# Altium schematic sheet TG21_mach_nut_nhan _V1_ReV.SchDoc
size A1; SheetNumber: 1; SheetTotal: 2
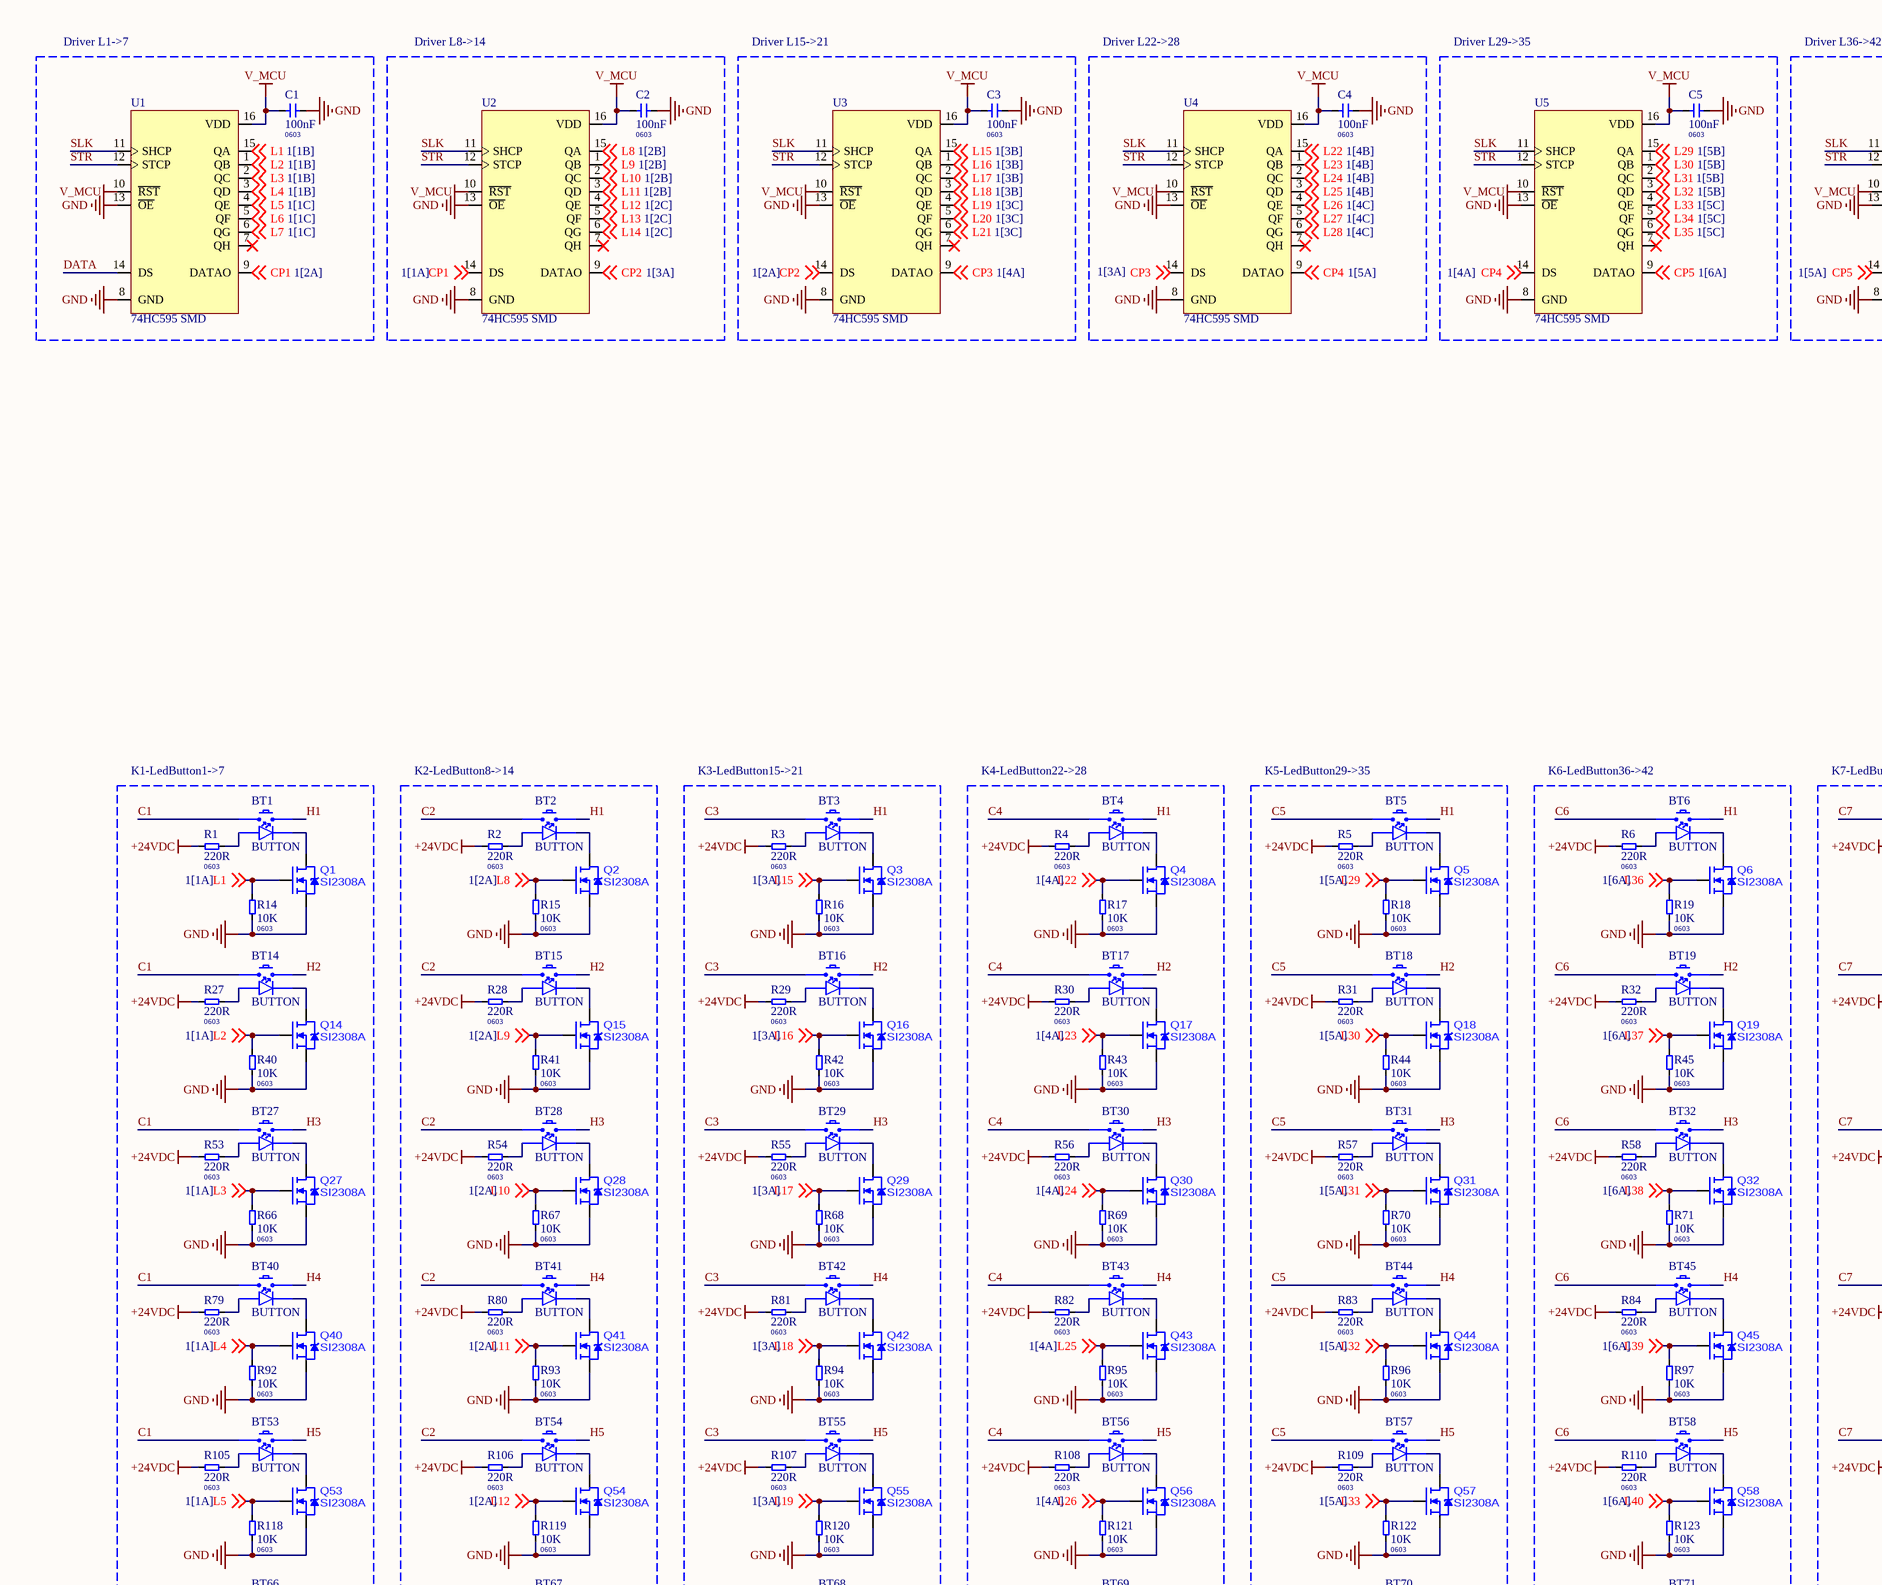
[diagram p0: TG21_mach_nut_nhan _V1_ReV.SchDoc, top left]
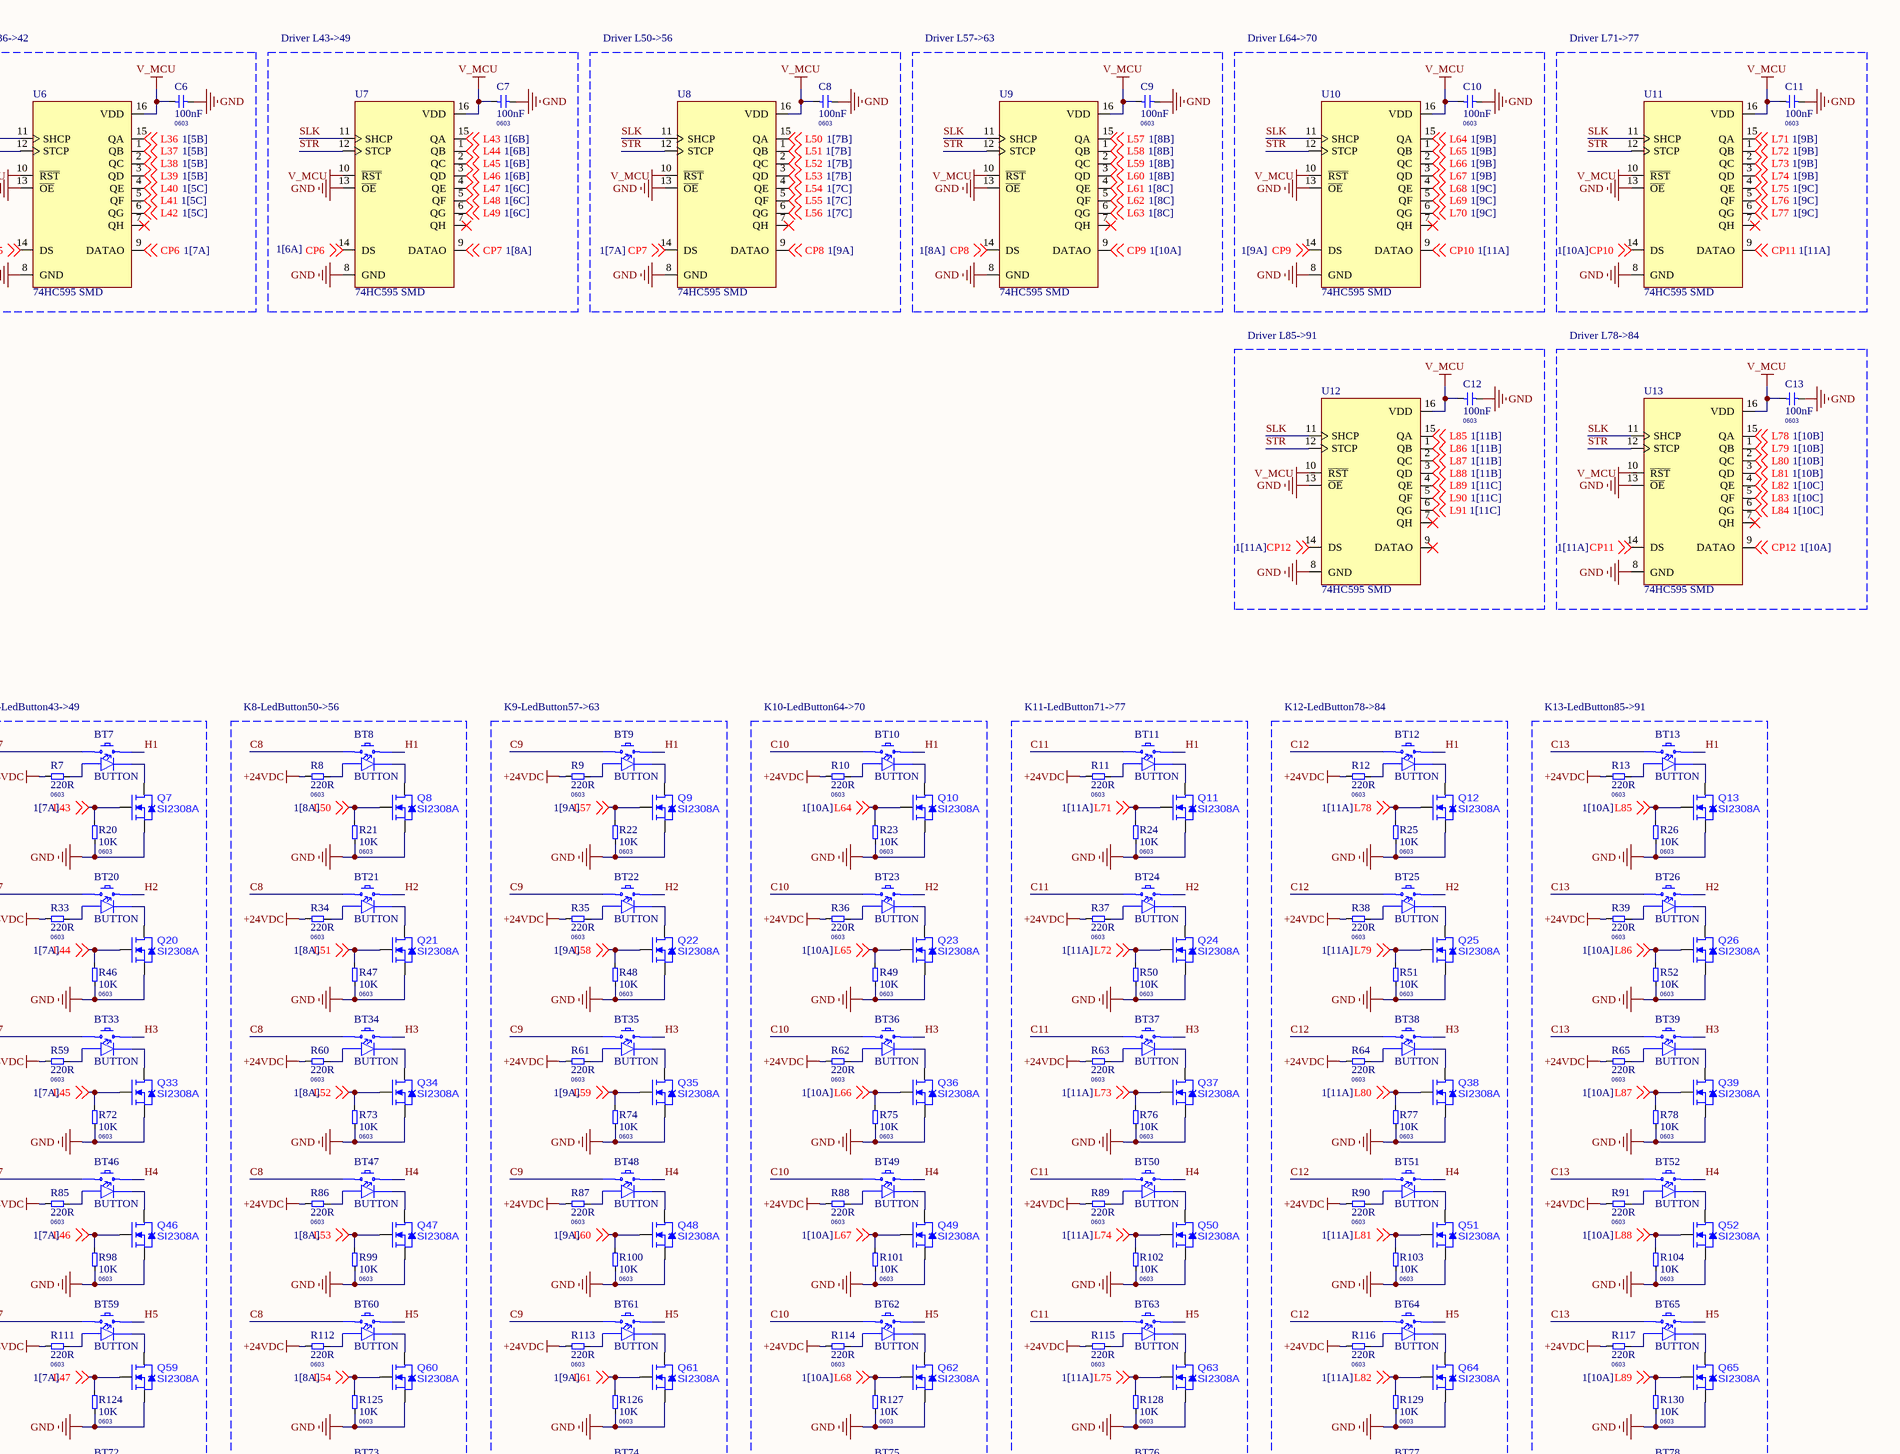
[diagram p1: TG21_mach_nut_nhan _V1_ReV.SchDoc, top right]
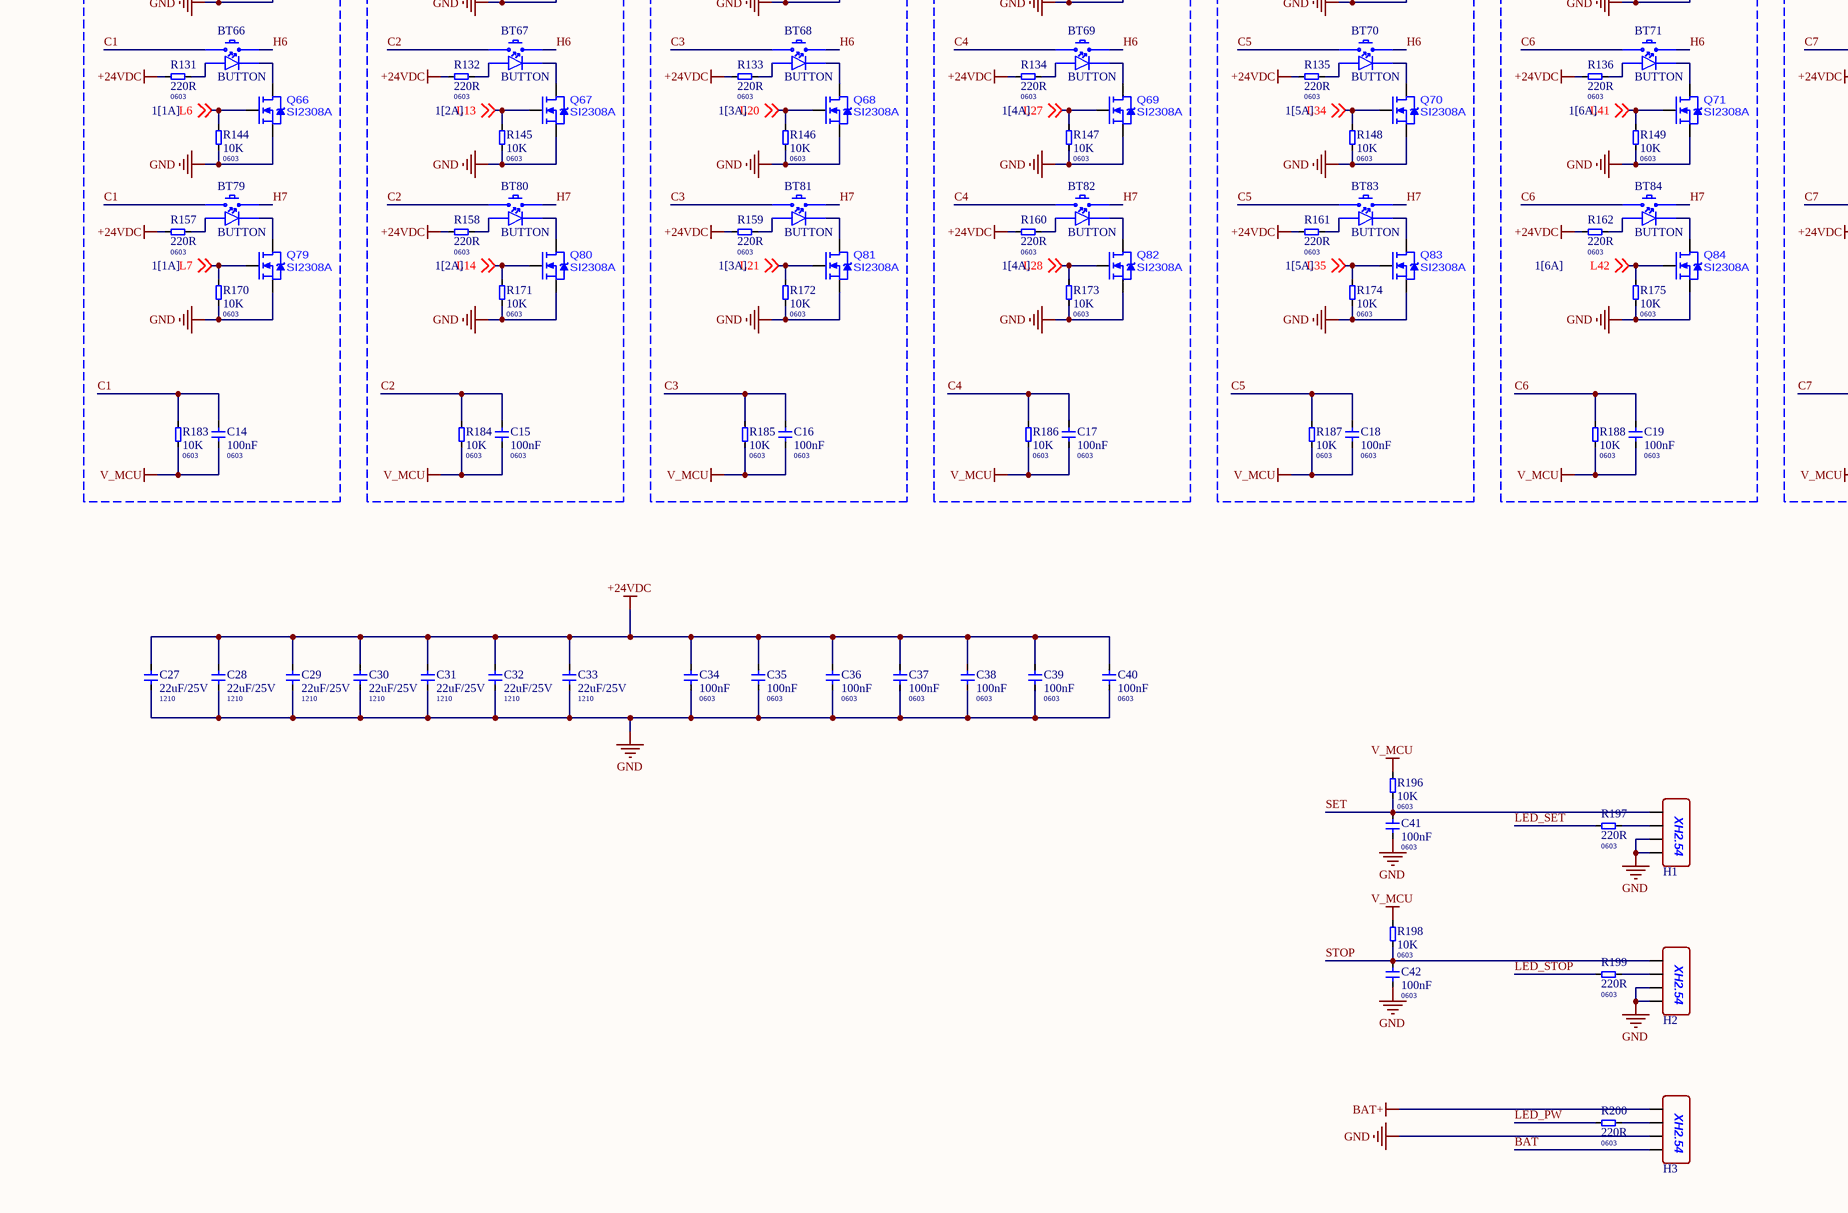
[diagram p2: TG21_mach_nut_nhan _V1_ReV.SchDoc, bottom left]
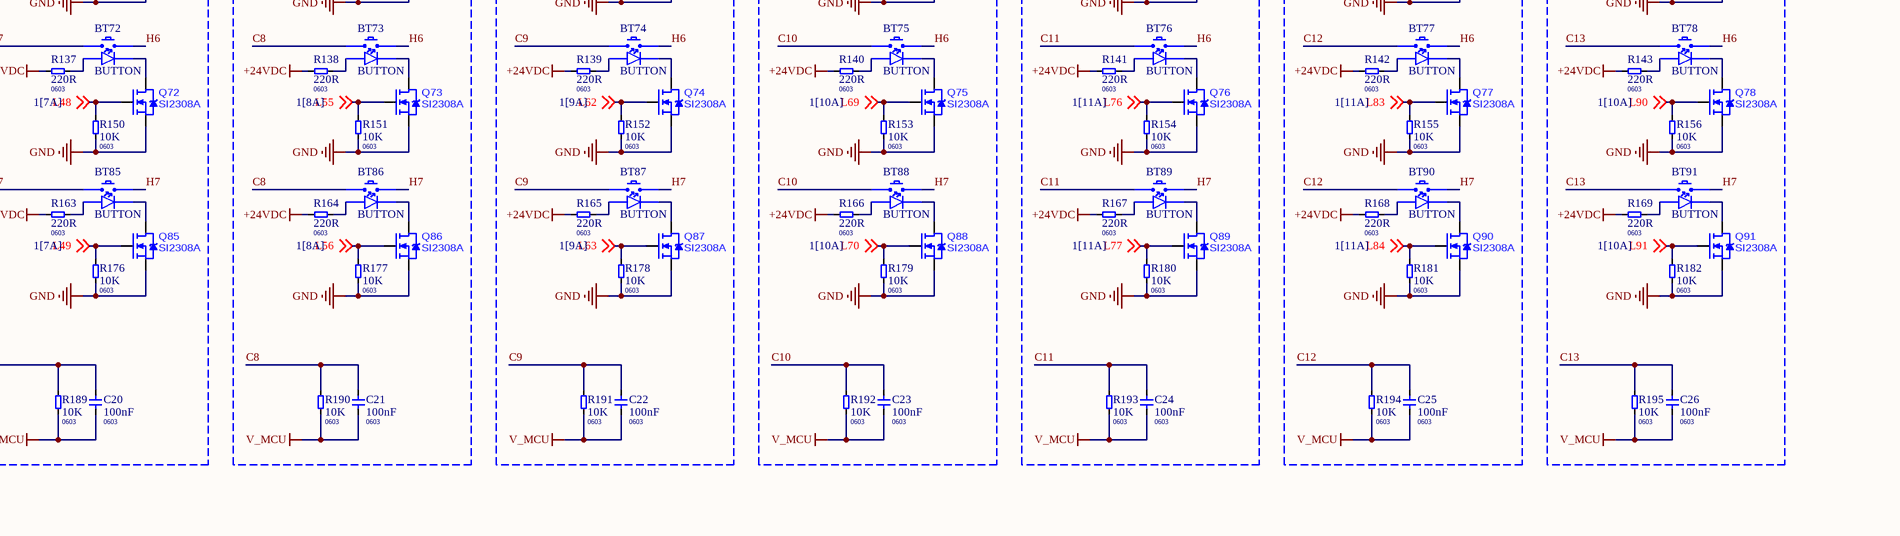
[diagram p3: TG21_mach_nut_nhan _V1_ReV.SchDoc, bottom right]

## Parts
BT1  BUTTON  [Metal Push Button Switch]
BT2  BUTTON  [Metal Push Button Switch]
BT3  BUTTON  [Metal Push Button Switch]
BT4  BUTTON  [Metal Push Button Switch]
BT5  BUTTON  [Metal Push Button Switch]
BT6  BUTTON  [Metal Push Button Switch]
BT7  BUTTON  [Metal Push Button Switch]
BT8  BUTTON  [Metal Push Button Switch]
BT9  BUTTON  [Metal Push Button Switch]
BT10  BUTTON  [Metal Push Button Switch]
BT11  BUTTON  [Metal Push Button Switch]
BT12  BUTTON  [Metal Push Button Switch]
BT13  BUTTON  [Metal Push Button Switch]
BT14  BUTTON  [Metal Push Button Switch]
BT15  BUTTON  [Metal Push Button Switch]
BT16  BUTTON  [Metal Push Button Switch]
BT17  BUTTON  [Metal Push Button Switch]
BT18  BUTTON  [Metal Push Button Switch]
BT19  BUTTON  [Metal Push Button Switch]
BT20  BUTTON  [Metal Push Button Switch]
BT21  BUTTON  [Metal Push Button Switch]
BT22  BUTTON  [Metal Push Button Switch]
BT23  BUTTON  [Metal Push Button Switch]
BT24  BUTTON  [Metal Push Button Switch]
BT25  BUTTON  [Metal Push Button Switch]
BT26  BUTTON  [Metal Push Button Switch]
BT27  BUTTON  [Metal Push Button Switch]
BT28  BUTTON  [Metal Push Button Switch]
BT29  BUTTON  [Metal Push Button Switch]
BT30  BUTTON  [Metal Push Button Switch]
BT31  BUTTON  [Metal Push Button Switch]
BT32  BUTTON  [Metal Push Button Switch]
BT33  BUTTON  [Metal Push Button Switch]
BT34  BUTTON  [Metal Push Button Switch]
BT35  BUTTON  [Metal Push Button Switch]
BT36  BUTTON  [Metal Push Button Switch]
BT37  BUTTON  [Metal Push Button Switch]
BT38  BUTTON  [Metal Push Button Switch]
BT39  BUTTON  [Metal Push Button Switch]
BT40  BUTTON  [Metal Push Button Switch]
BT41  BUTTON  [Metal Push Button Switch]
BT42  BUTTON  [Metal Push Button Switch]
BT43  BUTTON  [Metal Push Button Switch]
BT44  BUTTON  [Metal Push Button Switch]
BT45  BUTTON  [Metal Push Button Switch]
BT46  BUTTON  [Metal Push Button Switch]
BT47  BUTTON  [Metal Push Button Switch]
BT48  BUTTON  [Metal Push Button Switch]
BT49  BUTTON  [Metal Push Button Switch]
BT50  BUTTON  [Metal Push Button Switch]
BT51  BUTTON  [Metal Push Button Switch]
BT52  BUTTON  [Metal Push Button Switch]
BT53  BUTTON  [Metal Push Button Switch]
BT54  BUTTON  [Metal Push Button Switch]
BT55  BUTTON  [Metal Push Button Switch]
BT56  BUTTON  [Metal Push Button Switch]
BT57  BUTTON  [Metal Push Button Switch]
BT58  BUTTON  [Metal Push Button Switch]
BT59  BUTTON  [Metal Push Button Switch]
BT60  BUTTON  [Metal Push Button Switch]
BT61  BUTTON  [Metal Push Button Switch]
BT62  BUTTON  [Metal Push Button Switch]
BT63  BUTTON  [Metal Push Button Switch]
BT64  BUTTON  [Metal Push Button Switch]
BT65  BUTTON  [Metal Push Button Switch]
BT66  BUTTON  [Metal Push Button Switch]
BT67  BUTTON  [Metal Push Button Switch]
BT68  BUTTON  [Metal Push Button Switch]
BT69  BUTTON  [Metal Push Button Switch]
BT70  BUTTON  [Metal Push Button Switch]
BT71  BUTTON  [Metal Push Button Switch]
BT72  BUTTON  [Metal Push Button Switch]
BT73  BUTTON  [Metal Push Button Switch]
BT74  BUTTON  [Metal Push Button Switch]
BT75  BUTTON  [Metal Push Button Switch]
BT76  BUTTON  [Metal Push Button Switch]
BT77  BUTTON  [Metal Push Button Switch]
BT78  BUTTON  [Metal Push Button Switch]
BT79  BUTTON  [Metal Push Button Switch]
BT80  BUTTON  [Metal Push Button Switch]
BT81  BUTTON  [Metal Push Button Switch]
BT82  BUTTON  [Metal Push Button Switch]
BT83  BUTTON  [Metal Push Button Switch]
BT84  BUTTON  [Metal Push Button Switch]
BT85  BUTTON  [Metal Push Button Switch]
BT86  BUTTON  [Metal Push Button Switch]
BT87  BUTTON  [Metal Push Button Switch]
BT88  BUTTON  [Metal Push Button Switch]
BT89  BUTTON  [Metal Push Button Switch]
BT90  BUTTON  [Metal Push Button Switch]
BT91  BUTTON  [Metal Push Button Switch]
C1  100nF  Package: 0603  [0603 MLCC]
C2  100nF  Package: 0603  [0603 MLCC]
C3  100nF  Package: 0603  [0603 MLCC]
C4  100nF  Package: 0603  [0603 MLCC]
C5  100nF  Package: 0603  [0603 MLCC]
C6  100nF  Package: 0603  [0603 MLCC]
C7  100nF  Package: 0603  [0603 MLCC]
C8  100nF  Package: 0603  [0603 MLCC]
C9  100nF  Package: 0603  [0603 MLCC]
C10  100nF  Package: 0603  [0603 MLCC]
C11  100nF  Package: 0603  [0603 MLCC]
C12  100nF  Package: 0603  [0603 MLCC]
C13  100nF  Package: 0603  [0603 MLCC]
C14  100nF  Package: 0603  [0603 MLCC]
C15  100nF  Package: 0603  [0603 MLCC]
C16  100nF  Package: 0603  [0603 MLCC]
C17  100nF  Package: 0603  [0603 MLCC]
C18  100nF  Package: 0603  [0603 MLCC]
C19  100nF  Package: 0603  [0603 MLCC]
C20  100nF  Package: 0603  [0603 MLCC]
C21  100nF  Package: 0603  [0603 MLCC]
C22  100nF  Package: 0603  [0603 MLCC]
C23  100nF  Package: 0603  [0603 MLCC]
C24  100nF  Package: 0603  [0603 MLCC]
C25  100nF  Package: 0603  [0603 MLCC]
C26  100nF  Package: 0603  [0603 MLCC]
C27  22uF/25V  Package: 1210  [1210 CAPACITOR]
C28  22uF/25V  Package: 1210  [1210 CAPACITOR]
C29  22uF/25V  Package: 1210  [1210 CAPACITOR]
C30  22uF/25V  Package: 1210  [1210 CAPACITOR]
C31  22uF/25V  Package: 1210  [1210 CAPACITOR]
C32  22uF/25V  Package: 1210  [1210 CAPACITOR]
C33  22uF/25V  Package: 1210  [1210 CAPACITOR]
C34  100nF  Package: 0603  [0603 MLCC]
C35  100nF  Package: 0603  [0603 MLCC]
C36  100nF  Package: 0603  [0603 MLCC]
C37  100nF  Package: 0603  [0603 MLCC]
C38  100nF  Package: 0603  [0603 MLCC]
C39  100nF  Package: 0603  [0603 MLCC]
C40  100nF  Package: 0603  [0603 MLCC]
C41  100nF  Package: 0603  [0603 MLCC]
C42  100nF  Package: 0603  [0603 MLCC]
H1  XY-XH2.54-4PZZ  [XH2.54 - 4PZZ]  (value not drawn)
H2  XY-XH2.54-4PZZ  [XH2.54 - 4PZZ]  (value not drawn)
H3  XY-XH2.54-4PZZ  [XH2.54 - 4PZZ]  (value not drawn)
Q1  SI2308A  [SOT23_HVT]
Q2  SI2308A  [SOT23_HVT]
Q3  SI2308A  [SOT23_HVT]
Q4  SI2308A  [SOT23_HVT]
Q5  SI2308A  [SOT23_HVT]
Q6  SI2308A  [SOT23_HVT]
Q7  SI2308A  [SOT23_HVT]
Q8  SI2308A  [SOT23_HVT]
Q9  SI2308A  [SOT23_HVT]
Q10  SI2308A  [SOT23_HVT]
Q11  SI2308A  [SOT23_HVT]
Q12  SI2308A  [SOT23_HVT]
Q13  SI2308A  [SOT23_HVT]
Q14  SI2308A  [SOT23_HVT]
Q15  SI2308A  [SOT23_HVT]
Q16  SI2308A  [SOT23_HVT]
Q17  SI2308A  [SOT23_HVT]
Q18  SI2308A  [SOT23_HVT]
Q19  SI2308A  [SOT23_HVT]
Q20  SI2308A  [SOT23_HVT]
Q21  SI2308A  [SOT23_HVT]
Q22  SI2308A  [SOT23_HVT]
Q23  SI2308A  [SOT23_HVT]
Q24  SI2308A  [SOT23_HVT]
Q25  SI2308A  [SOT23_HVT]
Q26  SI2308A  [SOT23_HVT]
Q27  SI2308A  [SOT23_HVT]
Q28  SI2308A  [SOT23_HVT]
Q29  SI2308A  [SOT23_HVT]
Q30  SI2308A  [SOT23_HVT]
Q31  SI2308A  [SOT23_HVT]
Q32  SI2308A  [SOT23_HVT]
Q33  SI2308A  [SOT23_HVT]
Q34  SI2308A  [SOT23_HVT]
Q35  SI2308A  [SOT23_HVT]
Q36  SI2308A  [SOT23_HVT]
Q37  SI2308A  [SOT23_HVT]
Q38  SI2308A  [SOT23_HVT]
Q39  SI2308A  [SOT23_HVT]
Q40  SI2308A  [SOT23_HVT]
Q41  SI2308A  [SOT23_HVT]
Q42  SI2308A  [SOT23_HVT]
Q43  SI2308A  [SOT23_HVT]
Q44  SI2308A  [SOT23_HVT]
Q45  SI2308A  [SOT23_HVT]
Q46  SI2308A  [SOT23_HVT]
Q47  SI2308A  [SOT23_HVT]
Q48  SI2308A  [SOT23_HVT]
Q49  SI2308A  [SOT23_HVT]
Q50  SI2308A  [SOT23_HVT]
Q51  SI2308A  [SOT23_HVT]
Q52  SI2308A  [SOT23_HVT]
Q53  SI2308A  [SOT23_HVT]
Q54  SI2308A  [SOT23_HVT]
Q55  SI2308A  [SOT23_HVT]
Q56  SI2308A  [SOT23_HVT]
Q57  SI2308A  [SOT23_HVT]
Q58  SI2308A  [SOT23_HVT]
Q59  SI2308A  [SOT23_HVT]
Q60  SI2308A  [SOT23_HVT]
Q61  SI2308A  [SOT23_HVT]
Q62  SI2308A  [SOT23_HVT]
Q63  SI2308A  [SOT23_HVT]
Q64  SI2308A  [SOT23_HVT]
Q65  SI2308A  [SOT23_HVT]
Q66  SI2308A  [SOT23_HVT]
Q67  SI2308A  [SOT23_HVT]
Q68  SI2308A  [SOT23_HVT]
Q69  SI2308A  [SOT23_HVT]
Q70  SI2308A  [SOT23_HVT]
Q71  SI2308A  [SOT23_HVT]
Q72  SI2308A  [SOT23_HVT]
Q73  SI2308A  [SOT23_HVT]
Q74  SI2308A  [SOT23_HVT]
Q75  SI2308A  [SOT23_HVT]
Q76  SI2308A  [SOT23_HVT]
Q77  SI2308A  [SOT23_HVT]
Q78  SI2308A  [SOT23_HVT]
Q79  SI2308A  [SOT23_HVT]
Q80  SI2308A  [SOT23_HVT]
Q81  SI2308A  [SOT23_HVT]
Q82  SI2308A  [SOT23_HVT]
Q83  SI2308A  [SOT23_HVT]
Q84  SI2308A  [SOT23_HVT]
Q85  SI2308A  [SOT23_HVT]
Q86  SI2308A  [SOT23_HVT]
Q87  SI2308A  [SOT23_HVT]
Q88  SI2308A  [SOT23_HVT]
Q89  SI2308A  [SOT23_HVT]
Q90  SI2308A  [SOT23_HVT]
Q91  SI2308A  [SOT23_HVT]
R1  220R  Package: 0603  [0603 MLCC]
R2  220R  Package: 0603  [0603 MLCC]
R3  220R  Package: 0603  [0603 MLCC]
R4  220R  Package: 0603  [0603 MLCC]
R5  220R  Package: 0603  [0603 MLCC]
R6  220R  Package: 0603  [0603 MLCC]
R7  220R  Package: 0603  [0603 MLCC]
R8  220R  Package: 0603  [0603 MLCC]
R9  220R  Package: 0603  [0603 MLCC]
R10  220R  Package: 0603  [0603 MLCC]
R11  220R  Package: 0603  [0603 MLCC]
R12  220R  Package: 0603  [0603 MLCC]
R13  220R  Package: 0603  [0603 MLCC]
R14  10K  Package: 0603  [0603 Resistors]
R15  10K  Package: 0603  [0603 Resistors]
R16  10K  Package: 0603  [0603 Resistors]
R17  10K  Package: 0603  [0603 Resistors]
R18  10K  Package: 0603  [0603 Resistors]
R19  10K  Package: 0603  [0603 Resistors]
R20  10K  Package: 0603  [0603 Resistors]
R21  10K  Package: 0603  [0603 Resistors]
R22  10K  Package: 0603  [0603 Resistors]
R23  10K  Package: 0603  [0603 Resistors]
R24  10K  Package: 0603  [0603 Resistors]
R25  10K  Package: 0603  [0603 Resistors]
R26  10K  Package: 0603  [0603 Resistors]
R27  220R  Package: 0603  [0603 MLCC]
R28  220R  Package: 0603  [0603 MLCC]
R29  220R  Package: 0603  [0603 MLCC]
R30  220R  Package: 0603  [0603 MLCC]
R31  220R  Package: 0603  [0603 MLCC]
R32  220R  Package: 0603  [0603 MLCC]
R33  220R  Package: 0603  [0603 MLCC]
R34  220R  Package: 0603  [0603 MLCC]
R35  220R  Package: 0603  [0603 MLCC]
R36  220R  Package: 0603  [0603 MLCC]
R37  220R  Package: 0603  [0603 MLCC]
R38  220R  Package: 0603  [0603 MLCC]
R39  220R  Package: 0603  [0603 MLCC]
R40  10K  Package: 0603  [0603 Resistors]
R41  10K  Package: 0603  [0603 Resistors]
R42  10K  Package: 0603  [0603 Resistors]
R43  10K  Package: 0603  [0603 Resistors]
R44  10K  Package: 0603  [0603 Resistors]
R45  10K  Package: 0603  [0603 Resistors]
R46  10K  Package: 0603  [0603 Resistors]
R47  10K  Package: 0603  [0603 Resistors]
R48  10K  Package: 0603  [0603 Resistors]
R49  10K  Package: 0603  [0603 Resistors]
R50  10K  Package: 0603  [0603 Resistors]
R51  10K  Package: 0603  [0603 Resistors]
R52  10K  Package: 0603  [0603 Resistors]
R53  220R  Package: 0603  [0603 MLCC]
R54  220R  Package: 0603  [0603 MLCC]
R55  220R  Package: 0603  [0603 MLCC]
R56  220R  Package: 0603  [0603 MLCC]
R57  220R  Package: 0603  [0603 MLCC]
R58  220R  Package: 0603  [0603 MLCC]
R59  220R  Package: 0603  [0603 MLCC]
R60  220R  Package: 0603  [0603 MLCC]
R61  220R  Package: 0603  [0603 MLCC]
R62  220R  Package: 0603  [0603 MLCC]
R63  220R  Package: 0603  [0603 MLCC]
R64  220R  Package: 0603  [0603 MLCC]
R65  220R  Package: 0603  [0603 MLCC]
R66  10K  Package: 0603  [0603 Resistors]
R67  10K  Package: 0603  [0603 Resistors]
R68  10K  Package: 0603  [0603 Resistors]
R69  10K  Package: 0603  [0603 Resistors]
R70  10K  Package: 0603  [0603 Resistors]
R71  10K  Package: 0603  [0603 Resistors]
R72  10K  Package: 0603  [0603 Resistors]
R73  10K  Package: 0603  [0603 Resistors]
R74  10K  Package: 0603  [0603 Resistors]
R75  10K  Package: 0603  [0603 Resistors]
R76  10K  Package: 0603  [0603 Resistors]
R77  10K  Package: 0603  [0603 Resistors]
R78  10K  Package: 0603  [0603 Resistors]
R79  220R  Package: 0603  [0603 MLCC]
R80  220R  Package: 0603  [0603 MLCC]
R81  220R  Package: 0603  [0603 MLCC]
R82  220R  Package: 0603  [0603 MLCC]
R83  220R  Package: 0603  [0603 MLCC]
R84  220R  Package: 0603  [0603 MLCC]
R85  220R  Package: 0603  [0603 MLCC]
R86  220R  Package: 0603  [0603 MLCC]
R87  220R  Package: 0603  [0603 MLCC]
R88  220R  Package: 0603  [0603 MLCC]
R89  220R  Package: 0603  [0603 MLCC]
R90  220R  Package: 0603  [0603 MLCC]
R91  220R  Package: 0603  [0603 MLCC]
R92  10K  Package: 0603  [0603 Resistors]
R93  10K  Package: 0603  [0603 Resistors]
R94  10K  Package: 0603  [0603 Resistors]
R95  10K  Package: 0603  [0603 Resistors]
R96  10K  Package: 0603  [0603 Resistors]
R97  10K  Package: 0603  [0603 Resistors]
R98  10K  Package: 0603  [0603 Resistors]
R99  10K  Package: 0603  [0603 Resistors]
R100  10K  Package: 0603  [0603 Resistors]
R101  10K  Package: 0603  [0603 Resistors]
R102  10K  Package: 0603  [0603 Resistors]
R103  10K  Package: 0603  [0603 Resistors]
R104  10K  Package: 0603  [0603 Resistors]
R105  220R  Package: 0603  [0603 MLCC]
R106  220R  Package: 0603  [0603 MLCC]
R107  220R  Package: 0603  [0603 MLCC]
R108  220R  Package: 0603  [0603 MLCC]
R109  220R  Package: 0603  [0603 MLCC]
R110  220R  Package: 0603  [0603 MLCC]
R111  220R  Package: 0603  [0603 MLCC]
R112  220R  Package: 0603  [0603 MLCC]
R113  220R  Package: 0603  [0603 MLCC]
R114  220R  Package: 0603  [0603 MLCC]
R115  220R  Package: 0603  [0603 MLCC]
R116  220R  Package: 0603  [0603 MLCC]
R117  220R  Package: 0603  [0603 MLCC]
R118  10K  Package: 0603  [0603 Resistors]
R119  10K  Package: 0603  [0603 Resistors]
R120  10K  Package: 0603  [0603 Resistors]
R121  10K  Package: 0603  [0603 Resistors]
R122  10K  Package: 0603  [0603 Resistors]
R123  10K  Package: 0603  [0603 Resistors]
R124  10K  Package: 0603  [0603 Resistors]
R125  10K  Package: 0603  [0603 Resistors]
R126  10K  Package: 0603  [0603 Resistors]
R127  10K  Package: 0603  [0603 Resistors]
R128  10K  Package: 0603  [0603 Resistors]
R129  10K  Package: 0603  [0603 Resistors]
R130  10K  Package: 0603  [0603 Resistors]
R131  220R  Package: 0603  [0603 MLCC]
R132  220R  Package: 0603  [0603 MLCC]
R133  220R  Package: 0603  [0603 MLCC]
R134  220R  Package: 0603  [0603 MLCC]
R135  220R  Package: 0603  [0603 MLCC]
R136  220R  Package: 0603  [0603 MLCC]
R137  220R  Package: 0603  [0603 MLCC]
R138  220R  Package: 0603  [0603 MLCC]
R139  220R  Package: 0603  [0603 MLCC]
R140  220R  Package: 0603  [0603 MLCC]
R141  220R  Package: 0603  [0603 MLCC]
R142  220R  Package: 0603  [0603 MLCC]
R143  220R  Package: 0603  [0603 MLCC]
R144  10K  Package: 0603  [0603 Resistors]
R145  10K  Package: 0603  [0603 Resistors]
R146  10K  Package: 0603  [0603 Resistors]
R147  10K  Package: 0603  [0603 Resistors]
R148  10K  Package: 0603  [0603 Resistors]
R149  10K  Package: 0603  [0603 Resistors]
R150  10K  Package: 0603  [0603 Resistors]
R151  10K  Package: 0603  [0603 Resistors]
R152  10K  Package: 0603  [0603 Resistors]
R153  10K  Package: 0603  [0603 Resistors]
R154  10K  Package: 0603  [0603 Resistors]
R155  10K  Package: 0603  [0603 Resistors]
R156  10K  Package: 0603  [0603 Resistors]
R157  220R  Package: 0603  [0603 MLCC]
R158  220R  Package: 0603  [0603 MLCC]
R159  220R  Package: 0603  [0603 MLCC]
R160  220R  Package: 0603  [0603 MLCC]
R161  220R  Package: 0603  [0603 MLCC]
R162  220R  Package: 0603  [0603 MLCC]
R163  220R  Package: 0603  [0603 MLCC]
R164  220R  Package: 0603  [0603 MLCC]
R165  220R  Package: 0603  [0603 MLCC]
R166  220R  Package: 0603  [0603 MLCC]
R167  220R  Package: 0603  [0603 MLCC]
R168  220R  Package: 0603  [0603 MLCC]
R169  220R  Package: 0603  [0603 MLCC]
R170  10K  Package: 0603  [0603 Resistors]
R171  10K  Package: 0603  [0603 Resistors]
R172  10K  Package: 0603  [0603 Resistors]
R173  10K  Package: 0603  [0603 Resistors]
R174  10K  Package: 0603  [0603 Resistors]
R175  10K  Package: 0603  [0603 Resistors]
R176  10K  Package: 0603  [0603 Resistors]
R177  10K  Package: 0603  [0603 Resistors]
R178  10K  Package: 0603  [0603 Resistors]
R179  10K  Package: 0603  [0603 Resistors]
R180  10K  Package: 0603  [0603 Resistors]
R181  10K  Package: 0603  [0603 Resistors]
R182  10K  Package: 0603  [0603 Resistors]
R183  10K  Package: 0603  [0603 Resistors]
R184  10K  Package: 0603  [0603 Resistors]
R185  10K  Package: 0603  [0603 Resistors]
R186  10K  Package: 0603  [0603 Resistors]
R187  10K  Package: 0603  [0603 Resistors]
R188  10K  Package: 0603  [0603 Resistors]
R189  10K  Package: 0603  [0603 Resistors]
R190  10K  Package: 0603  [0603 Resistors]
R191  10K  Package: 0603  [0603 Resistors]
R192  10K  Package: 0603  [0603 Resistors]
R193  10K  Package: 0603  [0603 Resistors]
R194  10K  Package: 0603  [0603 Resistors]
R195  10K  Package: 0603  [0603 Resistors]
R196  10K  Package: 0603  [0603 Resistors]
R197  220R  Package: 0603  [0603 Resistors]
R198  10K  Package: 0603  [0603 Resistors]
R199  220R  Package: 0603  [0603 Resistors]
R200  220R  Package: 0603  [0603 Resistors]
U1  74HC595 SMD  [SOP 16]
U2  74HC595 SMD  [SOP 16]
U3  74HC595 SMD  [SOP 16]
U4  74HC595 SMD  [SOP 16]
U5  74HC595 SMD  [SOP 16]
U6  74HC595 SMD  [SOP 16]
U7  74HC595 SMD  [SOP 16]
U8  74HC595 SMD  [SOP 16]
U9  74HC595 SMD  [SOP 16]
U10  74HC595 SMD  [SOP 16]
U11  74HC595 SMD  [SOP 16]
U12  74HC595 SMD  [SOP 16]
U13  74HC595 SMD  [SOP 16]

## Blocks framed on the sheet
Driver L1->7: C1 U1
Driver L8->14: C2 U2
Driver L15->21: C3 U3
Driver L22->28: C4 U4
Driver L29->35: C5 U5
Driver L36->42: C6 U6
Driver L43->49: C7 U7
Driver L50->56: C8 U8
Driver L57->63: C9 U9
Driver L64->70: C10 U10
Driver L71->77: C11 U11
Driver L85->91: C12 U12
Driver L78->84: C13 U13
K1-LedButton1->7: BT1 BT14 BT27 BT40 BT53 BT66 BT79 C14 Q1 Q14 Q27 Q40 Q53 Q66 Q79 R1 R14 R27 R40 R53 R66 R79 R92 R105 R118 R131 R144 R157 R170 R183
K2-LedButton8->14: BT2 BT15 BT28 BT41 BT54 BT67 BT80 C15 Q2 Q15 Q28 Q41 Q54 Q67 Q80 R2 R15 R28 R41 R54 R67 R80 R93 R106 R119 R132 R145 R158 R171 R184
K3-LedButton15->21: BT3 BT16 BT29 BT42 BT55 BT68 BT81 C16 Q3 Q16 Q29 Q42 Q55 Q68 Q81 R3 R16 R29 R42 R55 R68 R81 R94 R107 R120 R133 R146 R159 R172 R185
K4-LedButton22->28: BT4 BT17 BT30 BT43 BT56 BT69 BT82 C17 Q4 Q17 Q30 Q43 Q56 Q69 Q82 R4 R17 R30 R43 R56 R69 R82 R95 R108 R121 R134 R147 R160 R173 R186
K5-LedButton29->35: BT5 BT18 BT31 BT44 BT57 BT70 BT83 C18 Q5 Q18 Q31 Q44 Q57 Q70 Q83 R5 R18 R31 R44 R57 R70 R83 R96 R109 R122 R135 R148 R161 R174 R187
K6-LedButton36->42: BT6 BT19 BT32 BT45 BT58 BT71 BT84 C19 Q6 Q19 Q32 Q45 Q58 Q71 Q84 R6 R19 R32 R45 R58 R71 R84 R97 R110 R123 R136 R149 R162 R175 R188
K7-LedButton43->49: BT7 BT20 BT33 BT46 BT59 BT72 BT85 C20 Q7 Q20 Q33 Q46 Q59 Q72 Q85 R7 R20 R33 R46 R59 R72 R85 R98 R111 R124 R137 R150 R163 R176 R189
K8-LedButton50->56: BT8 BT21 BT34 BT47 BT60 BT73 BT86 C21 Q8 Q21 Q34 Q47 Q60 Q73 Q86 R8 R21 R34 R47 R60 R73 R86 R99 R112 R125 R138 R151 R164 R177 R190
K9-LedButton57->63: BT9 BT22 BT35 BT48 BT61 BT74 BT87 C22 Q9 Q22 Q35 Q48 Q61 Q74 Q87 R9 R22 R35 R48 R61 R74 R87 R100 R113 R126 R139 R152 R165 R178 R191
K10-LedButton64->70: BT10 BT23 BT36 BT49 BT62 BT75 BT88 C23 Q10 Q23 Q36 Q49 Q62 Q75 Q88 R10 R23 R36 R49 R62 R75 R88 R101 R114 R127 R140 R153 R166 R179 R192
K11-LedButton71->77: BT11 BT24 BT37 BT50 BT63 BT76 BT89 C24 Q11 Q24 Q37 Q50 Q63 Q76 Q89 R11 R24 R37 R50 R63 R76 R89 R102 R115 R128 R141 R154 R167 R180 R193
K12-LedButton78->84: BT12 BT25 BT38 BT51 BT64 BT77 BT90 C25 Q12 Q25 Q38 Q51 Q64 Q77 Q90 R12 R25 R38 R51 R64 R77 R90 R103 R116 R129 R142 R155 R168 R181 R194
K13-LedButton85->91: BT13 BT26 BT39 BT52 BT65 BT78 BT91 C26 Q13 Q26 Q39 Q52 Q65 Q78 Q91 R13 R26 R39 R52 R65 R78 R91 R104 R117 R130 R143 R156 R169 R182 R195

## Nets
+24VDC: C27.2 C28.2 C29.2 C30.2 C31.2 C32.2 C33.2 C34.2 C35.2 C36.2 C37.2 C38.2 C39.2 C40.2 R1.1 R2.1 R3.1 R4.1 R5.1 R6.1 R7.1 R8.1 R9.1 R10.1 R11.1 R12.1 R13.1 R27.1 R28.1 R29.1 R30.1 R31.1 R32.1 R33.1 R34.1 R35.1 R36.1 R37.1 R38.1 R39.1 R53.1 R54.1 R55.1 R56.1 R57.1 R58.1 R59.1 R60.1 R61.1 R62.1 R63.1 R64.1 R65.1 R79.1 R80.1 R81.1 R82.1 R83.1 R84.1 R85.1 R86.1 R87.1 R88.1 R89.1 R90.1 R91.1 R105.1 R106.1 R107.1 R108.1 R109.1 R110.1 R111.1 R112.1 R113.1 R114.1 R115.1 R116.1 R117.1 R131.1 R132.1 R133.1 R134.1 R135.1 R136.1 R137.1 R138.1 R139.1 R140.1 R141.1 R142.1 R143.1 R157.1 R158.1 R159.1 R160.1 R161.1 R162.1 R163.1 R164.1 R165.1 R166.1 R167.1 R168.1 R169.1
BAT+: H3.4
GND: C1.1 C2.1 C3.1 C4.1 C5.1 C6.1 C7.1 C8.1 C9.1 C10.1 C11.1 C12.1 C13.1 C27.1 C28.1 C29.1 C30.1 C31.1 C32.1 C33.1 C34.1 C35.1 C36.1 C37.1 C38.1 C39.1 C40.1 C41.2 C42.2 H1.1 H1.2 H2.1 H2.2 H3.2 Q1.2(S) Q2.2(S) Q3.2(S) Q4.2(S) Q5.2(S) Q6.2(S) Q7.2(S) Q8.2(S) Q9.2(S) Q10.2(S) Q11.2(S) Q12.2(S) Q13.2(S) Q14.2(S) Q15.2(S) Q16.2(S) Q17.2(S) Q18.2(S) Q19.2(S) Q20.2(S) Q21.2(S) Q22.2(S) Q23.2(S) Q24.2(S) Q25.2(S) Q26.2(S) Q27.2(S) Q28.2(S) Q29.2(S) Q30.2(S) Q31.2(S) Q32.2(S) Q33.2(S) Q34.2(S) Q35.2(S) Q36.2(S) Q37.2(S) Q38.2(S) Q39.2(S) Q40.2(S) Q41.2(S) Q42.2(S) Q43.2(S) Q44.2(S) Q45.2(S) Q46.2(S) Q47.2(S) Q48.2(S) Q49.2(S) Q50.2(S) Q51.2(S) Q52.2(S) Q53.2(S) Q54.2(S) Q55.2(S) Q56.2(S) Q57.2(S) Q58.2(S) Q59.2(S) Q60.2(S) Q61.2(S) Q62.2(S) Q63.2(S) Q64.2(S) Q65.2(S) Q66.2(S) Q67.2(S) Q68.2(S) Q69.2(S) Q70.2(S) Q71.2(S) Q72.2(S) Q73.2(S) Q74.2(S) Q75.2(S) Q76.2(S) Q77.2(S) Q78.2(S) Q79.2(S) Q80.2(S) Q81.2(S) Q82.2(S) Q83.2(S) Q84.2(S) Q85.2(S) Q86.2(S) Q87.2(S) Q88.2(S) Q89.2(S) Q90.2(S) Q91.2(S) R14.1 R15.1 R16.1 R17.1 R18.1 R19.1 R20.1 R21.1 R22.1 R23.1 R24.1 R25.1 R26.1 R40.1 R41.1 R42.1 R43.1 R44.1 R45.1 R46.1 R47.1 R48.1 R49.1 R50.1 R51.1 R52.1 R66.1 R67.1 R68.1 R69.1 R70.1 R71.1 R72.1 R73.1 R74.1 R75.1 R76.1 R77.1 R78.1 R92.1 R93.1 R94.1 R95.1 R96.1 R97.1 R98.1 R99.1 R100.1 R101.1 R102.1 R103.1 R104.1 R118.1 R119.1 R120.1 R121.1 R122.1 R123.1 R124.1 R125.1 R126.1 R127.1 R128.1 R129.1 R130.1 R144.1 R145.1 R146.1 R147.1 R148.1 R149.1 R150.1 R151.1 R152.1 R153.1 R154.1 R155.1 R156.1 R170.1 R171.1 R172.1 R173.1 R174.1 R175.1 R176.1 R177.1 R178.1 R179.1 R180.1 R181.1 R182.1 U1.8(GND) U1.13(~{OE}) U2.8(GND) U2.13(~{OE}) U3.8(GND) U3.13(~{OE}) U4.8(GND) U4.13(~{OE}) U5.8(GND) U5.13(~{OE}) U6.8(GND) U6.13(~{OE}) U7.8(GND) U7.13(~{OE}) U8.8(GND) U8.13(~{OE}) U9.8(GND) U9.13(~{OE}) U10.8(GND) U10.13(~{OE}) U11.8(GND) U11.13(~{OE}) U12.8(GND) U12.13(~{OE}) U13.8(GND) U13.13(~{OE})
V_MCU: C1.2 C2.2 C3.2 C4.2 C5.2 C6.2 C7.2 C8.2 C9.2 C10.2 C11.2 C12.2 C13.2 C14.1 C15.1 C16.1 C17.1 C18.1 C19.1 C20.1 C21.1 C22.1 C23.1 C24.1 C25.1 C26.1 R183.2 R184.2 R185.2 R186.2 R187.2 R188.2 R189.2 R190.2 R191.2 R192.2 R193.2 R194.2 R195.2 R196.2 R198.2 U1.10(~{RST}) U1.16(VDD) U2.10(~{RST}) U2.16(VDD) U3.10(~{RST}) U3.16(VDD) U4.10(~{RST}) U4.16(VDD) U5.10(~{RST}) U5.16(VDD) U6.10(~{RST}) U6.16(VDD) U7.10(~{RST}) U7.16(VDD) U8.10(~{RST}) U8.16(VDD) U9.10(~{RST}) U9.16(VDD) U10.10(~{RST}) U10.16(VDD) U11.10(~{RST}) U11.16(VDD) U12.10(~{RST}) U12.16(VDD) U13.10(~{RST}) U13.16(VDD)
BAT: H3.1
C1: BT1.1 BT14.1 BT27.1 BT40.1 BT53.1 BT66.1 BT79.1 C14.2 R183.1
C2: BT2.1 BT15.1 BT28.1 BT41.1 BT54.1 BT67.1 BT80.1 C15.2 R184.1
C3: BT3.1 BT16.1 BT29.1 BT42.1 BT55.1 BT68.1 BT81.1 C16.2 R185.1
C4: BT4.1 BT17.1 BT30.1 BT43.1 BT56.1 BT69.1 BT82.1 C17.2 R186.1
C5: BT5.1 BT18.1 BT31.1 BT44.1 BT57.1 BT70.1 BT83.1 C18.2 R187.1
C6: BT6.1 BT19.1 BT32.1 BT45.1 BT58.1 BT71.1 BT84.1 C19.2 R188.1
C7: BT7.1 BT20.1 BT33.1 BT46.1 BT59.1 BT72.1 BT85.1 C20.2 R189.1
C8: BT8.1 BT21.1 BT34.1 BT47.1 BT60.1 BT73.1 BT86.1 C21.2 R190.1
C9: BT9.1 BT22.1 BT35.1 BT48.1 BT61.1 BT74.1 BT87.1 C22.2 R191.1
C10: BT10.1 BT23.1 BT36.1 BT49.1 BT62.1 BT75.1 BT88.1 C23.2 R192.1
C11: BT11.1 BT24.1 BT37.1 BT50.1 BT63.1 BT76.1 BT89.1 C24.2 R193.1
C12: BT12.1 BT25.1 BT38.1 BT51.1 BT64.1 BT77.1 BT90.1 C25.2 R194.1
C13: BT13.1 BT26.1 BT39.1 BT52.1 BT65.1 BT78.1 BT91.1 C26.2 R195.1
CP1: U1.9(DATAO) U2.14(DS) ; off-sheet CP1
CP2: U2.9(DATAO) U3.14(DS) ; off-sheet CP2
CP3: U3.9(DATAO) U4.14(DS) ; off-sheet CP3
CP4: U4.9(DATAO) U5.14(DS) ; off-sheet CP4
CP5: U5.9(DATAO) U6.14(DS) ; off-sheet CP5
CP6: U6.9(DATAO) U7.14(DS) ; off-sheet CP6
CP7: U7.9(DATAO) U8.14(DS) ; off-sheet CP7
CP8: U8.9(DATAO) U9.14(DS) ; off-sheet CP8
CP9: U9.9(DATAO) U10.14(DS) ; off-sheet CP9
CP10: U10.9(DATAO) U11.14(DS) ; off-sheet CP10
CP11: U11.9(DATAO) U13.14(DS) ; off-sheet CP11
CP12: U12.14(DS) U13.9(DATAO) ; off-sheet CP12
DATA: U1.14(DS)
H1: BT1.2 BT2.2 BT3.2 BT4.2 BT5.2 BT6.2 BT7.2 BT8.2 BT9.2 BT10.2 BT11.2 BT12.2 BT13.2
H2: BT14.2 BT15.2 BT16.2 BT17.2 BT18.2 BT19.2 BT20.2 BT21.2 BT22.2 BT23.2 BT24.2 BT25.2 BT26.2
H3: BT27.2 BT28.2 BT29.2 BT30.2 BT31.2 BT32.2 BT33.2 BT34.2 BT35.2 BT36.2 BT37.2 BT38.2 BT39.2
H4: BT40.2 BT41.2 BT42.2 BT43.2 BT44.2 BT45.2 BT46.2 BT47.2 BT48.2 BT49.2 BT50.2 BT51.2 BT52.2
H5: BT53.2 BT54.2 BT55.2 BT56.2 BT57.2 BT58.2 BT59.2 BT60.2 BT61.2 BT62.2 BT63.2 BT64.2 BT65.2
H6: BT66.2 BT67.2 BT68.2 BT69.2 BT70.2 BT71.2 BT72.2 BT73.2 BT74.2 BT75.2 BT76.2 BT77.2 BT78.2
H7: BT79.2 BT80.2 BT81.2 BT82.2 BT83.2 BT84.2 BT85.2 BT86.2 BT87.2 BT88.2 BT89.2 BT90.2 BT91.2
L1: Q1.1(G) R14.2 U1.15(QA) ; off-sheet L1
L2: Q14.1(G) R40.2 U1.1(QB) ; off-sheet L2
L3: Q27.1(G) R66.2 U1.2(QC) ; off-sheet L3
L4: Q40.1(G) R92.2 U1.3(QD) ; off-sheet L4
L5: Q53.1(G) R118.2 U1.4(QE) ; off-sheet L5
L6: Q66.1(G) R144.2 U1.5(QF) ; off-sheet L6
L7: Q79.1(G) R170.2 U1.6(QG) ; off-sheet L7
L8: Q2.1(G) R15.2 U2.15(QA) ; off-sheet L8
L9: Q15.1(G) R41.2 U2.1(QB) ; off-sheet L9
L10: Q28.1(G) R67.2 U2.2(QC) ; off-sheet L10
L11: Q41.1(G) R93.2 U2.3(QD) ; off-sheet L11
L12: Q54.1(G) R119.2 U2.4(QE) ; off-sheet L12
L13: Q67.1(G) R145.2 U2.5(QF) ; off-sheet L13
L14: Q80.1(G) R171.2 U2.6(QG) ; off-sheet L14
L15: Q3.1(G) R16.2 U3.15(QA) ; off-sheet L15
L16: Q16.1(G) R42.2 U3.1(QB) ; off-sheet L16
L17: Q29.1(G) R68.2 U3.2(QC) ; off-sheet L17
L18: Q42.1(G) R94.2 U3.3(QD) ; off-sheet L18
L19: Q55.1(G) R120.2 U3.4(QE) ; off-sheet L19
L20: Q68.1(G) R146.2 U3.5(QF) ; off-sheet L20
L21: Q81.1(G) R172.2 U3.6(QG) ; off-sheet L21
L22: Q4.1(G) R17.2 U4.15(QA) ; off-sheet L22
L23: Q17.1(G) R43.2 U4.1(QB) ; off-sheet L23
L24: Q30.1(G) R69.2 U4.2(QC) ; off-sheet L24
L25: Q43.1(G) R95.2 U4.3(QD) ; off-sheet L25
L26: Q56.1(G) R121.2 U4.4(QE) ; off-sheet L26
L27: Q69.1(G) R147.2 U4.5(QF) ; off-sheet L27
L28: Q82.1(G) R173.2 U4.6(QG) ; off-sheet L28
L29: Q5.1(G) R18.2 U5.15(QA) ; off-sheet L29
L30: Q18.1(G) R44.2 U5.1(QB) ; off-sheet L30
L31: Q31.1(G) R70.2 U5.2(QC) ; off-sheet L31
L32: Q44.1(G) R96.2 U5.3(QD) ; off-sheet L32
L33: Q57.1(G) R122.2 U5.4(QE) ; off-sheet L33
L34: Q70.1(G) R148.2 U5.5(QF) ; off-sheet L34
L35: Q83.1(G) R174.2 U5.6(QG) ; off-sheet L35
L36: Q6.1(G) R19.2 U6.15(QA) ; off-sheet L36
L37: Q19.1(G) R45.2 U6.1(QB) ; off-sheet L37
L38: Q32.1(G) R71.2 U6.2(QC) ; off-sheet L38
L39: Q45.1(G) R97.2 U6.3(QD) ; off-sheet L39
L40: Q58.1(G) R123.2 U6.4(QE) ; off-sheet L40
L41: Q71.1(G) R149.2 U6.5(QF) ; off-sheet L41
L42: Q84.1(G) R175.2 U6.6(QG) ; off-sheet L42
L43: Q7.1(G) R20.2 U7.15(QA) ; off-sheet L43
L44: Q20.1(G) R46.2 U7.1(QB) ; off-sheet L44
L45: Q33.1(G) R72.2 U7.2(QC) ; off-sheet L45
L46: Q46.1(G) R98.2 U7.3(QD) ; off-sheet L46
L47: Q59.1(G) R124.2 U7.4(QE) ; off-sheet L47
L48: Q72.1(G) R150.2 U7.5(QF) ; off-sheet L48
L49: Q85.1(G) R176.2 U7.6(QG) ; off-sheet L49
L50: Q8.1(G) R21.2 U8.15(QA) ; off-sheet L50
L51: Q21.1(G) R47.2 U8.1(QB) ; off-sheet L51
L52: Q34.1(G) R73.2 U8.2(QC) ; off-sheet L52
L53: Q47.1(G) R99.2 U8.3(QD) ; off-sheet L53
L54: Q60.1(G) R125.2 U8.4(QE) ; off-sheet L54
L55: Q73.1(G) R151.2 U8.5(QF) ; off-sheet L55
L56: Q86.1(G) R177.2 U8.6(QG) ; off-sheet L56
L57: Q9.1(G) R22.2 U9.15(QA) ; off-sheet L57
L58: Q22.1(G) R48.2 U9.1(QB) ; off-sheet L58
L59: Q35.1(G) R74.2 U9.2(QC) ; off-sheet L59
L60: Q48.1(G) R100.2 U9.3(QD) ; off-sheet L60
L61: Q61.1(G) R126.2 U9.4(QE) ; off-sheet L61
L62: Q74.1(G) R152.2 U9.5(QF) ; off-sheet L62
L63: Q87.1(G) R178.2 U9.6(QG) ; off-sheet L63
L64: Q10.1(G) R23.2 U10.15(QA) ; off-sheet L64
L65: Q23.1(G) R49.2 U10.1(QB) ; off-sheet L65
L66: Q36.1(G) R75.2 U10.2(QC) ; off-sheet L66
L67: Q49.1(G) R101.2 U10.3(QD) ; off-sheet L67
L68: Q62.1(G) R127.2 U10.4(QE) ; off-sheet L68
L69: Q75.1(G) R153.2 U10.5(QF) ; off-sheet L69
L70: Q88.1(G) R179.2 U10.6(QG) ; off-sheet L70
L71: Q11.1(G) R24.2 U11.15(QA) ; off-sheet L71
L72: Q24.1(G) R50.2 U11.1(QB) ; off-sheet L72
L73: Q37.1(G) R76.2 U11.2(QC) ; off-sheet L73
L74: Q50.1(G) R102.2 U11.3(QD) ; off-sheet L74
L75: Q63.1(G) R128.2 U11.4(QE) ; off-sheet L75
L76: Q76.1(G) R154.2 U11.5(QF) ; off-sheet L76
L77: Q89.1(G) R180.2 U11.6(QG) ; off-sheet L77
L78: Q12.1(G) R25.2 U13.15(QA) ; off-sheet L78
L79: Q25.1(G) R51.2 U13.1(QB) ; off-sheet L79
L80: Q38.1(G) R77.2 U13.2(QC) ; off-sheet L80
L81: Q51.1(G) R103.2 U13.3(QD) ; off-sheet L81
L82: Q64.1(G) R129.2 U13.4(QE) ; off-sheet L82
L83: Q77.1(G) R155.2 U13.5(QF) ; off-sheet L83
L84: Q90.1(G) R181.2 U13.6(QG) ; off-sheet L84
L85: Q13.1(G) R26.2 U12.15(QA) ; off-sheet L85
L86: Q26.1(G) R52.2 U12.1(QB) ; off-sheet L86
L87: Q39.1(G) R78.2 U12.2(QC) ; off-sheet L87
L88: Q52.1(G) R104.2 U12.3(QD) ; off-sheet L88
L89: Q65.1(G) R130.2 U12.4(QE) ; off-sheet L89
L90: Q78.1(G) R156.2 U12.5(QF) ; off-sheet L90
L91: Q91.1(G) R182.2 U12.6(QG) ; off-sheet L91
LED_PW: R200.1
LED_SET: R197.1
LED_STOP: R199.1
SET: C41.1 H1.4 R196.1
SLK: U1.11(SHCP) U2.11(SHCP) U3.11(SHCP) U4.11(SHCP) U5.11(SHCP) U6.11(SHCP) U7.11(SHCP) U8.11(SHCP) U9.11(SHCP) U10.11(SHCP) U11.11(SHCP) U12.11(SHCP) U13.11(SHCP)
STOP: C42.1 H2.4 R198.1
STR: U1.12(STCP) U2.12(STCP) U3.12(STCP) U4.12(STCP) U5.12(STCP) U6.12(STCP) U7.12(STCP) U8.12(STCP) U9.12(STCP) U10.12(STCP) U11.12(STCP) U12.12(STCP) U13.12(STCP)
NetBT1_3: BT1.3 R1.2
NetBT1_4: BT1.4 Q1.3(D)
NetBT2_3: BT2.3 R2.2
NetBT2_4: BT2.4 Q2.3(D)
NetBT3_3: BT3.3 R3.2
NetBT3_4: BT3.4 Q3.3(D)
NetBT4_3: BT4.3 R4.2
NetBT4_4: BT4.4 Q4.3(D)
NetBT5_3: BT5.3 R5.2
NetBT5_4: BT5.4 Q5.3(D)
NetBT6_3: BT6.3 R6.2
NetBT6_4: BT6.4 Q6.3(D)
NetBT7_3: BT7.3 R7.2
NetBT7_4: BT7.4 Q7.3(D)
NetBT8_3: BT8.3 R8.2
NetBT8_4: BT8.4 Q8.3(D)
NetBT9_3: BT9.3 R9.2
NetBT9_4: BT9.4 Q9.3(D)
NetBT10_3: BT10.3 R10.2
NetBT10_4: BT10.4 Q10.3(D)
NetBT11_3: BT11.3 R11.2
NetBT11_4: BT11.4 Q11.3(D)
NetBT12_3: BT12.3 R12.2
NetBT12_4: BT12.4 Q12.3(D)
NetBT13_3: BT13.3 R13.2
NetBT13_4: BT13.4 Q13.3(D)
NetBT14_3: BT14.3 R27.2
NetBT14_4: BT14.4 Q14.3(D)
NetBT15_3: BT15.3 R28.2
NetBT15_4: BT15.4 Q15.3(D)
NetBT16_3: BT16.3 R29.2
NetBT16_4: BT16.4 Q16.3(D)
NetBT17_3: BT17.3 R30.2
NetBT17_4: BT17.4 Q17.3(D)
NetBT18_3: BT18.3 R31.2
NetBT18_4: BT18.4 Q18.3(D)
NetBT19_3: BT19.3 R32.2
NetBT19_4: BT19.4 Q19.3(D)
NetBT20_3: BT20.3 R33.2
NetBT20_4: BT20.4 Q20.3(D)
NetBT21_3: BT21.3 R34.2
NetBT21_4: BT21.4 Q21.3(D)
NetBT22_3: BT22.3 R35.2
NetBT22_4: BT22.4 Q22.3(D)
NetBT23_3: BT23.3 R36.2
NetBT23_4: BT23.4 Q23.3(D)
NetBT24_3: BT24.3 R37.2
NetBT24_4: BT24.4 Q24.3(D)
NetBT25_3: BT25.3 R38.2
NetBT25_4: BT25.4 Q25.3(D)
NetBT26_3: BT26.3 R39.2
NetBT26_4: BT26.4 Q26.3(D)
NetBT27_3: BT27.3 R53.2
NetBT27_4: BT27.4 Q27.3(D)
NetBT28_3: BT28.3 R54.2
NetBT28_4: BT28.4 Q28.3(D)
NetBT29_3: BT29.3 R55.2
NetBT29_4: BT29.4 Q29.3(D)
NetBT30_3: BT30.3 R56.2
NetBT30_4: BT30.4 Q30.3(D)
NetBT31_3: BT31.3 R57.2
NetBT31_4: BT31.4 Q31.3(D)
NetBT32_3: BT32.3 R58.2
NetBT32_4: BT32.4 Q32.3(D)
NetBT33_3: BT33.3 R59.2
NetBT33_4: BT33.4 Q33.3(D)
NetBT34_3: BT34.3 R60.2
NetBT34_4: BT34.4 Q34.3(D)
NetBT35_3: BT35.3 R61.2
NetBT35_4: BT35.4 Q35.3(D)
NetBT36_3: BT36.3 R62.2
NetBT36_4: BT36.4 Q36.3(D)
NetBT37_3: BT37.3 R63.2
NetBT37_4: BT37.4 Q37.3(D)
NetBT38_3: BT38.3 R64.2
NetBT38_4: BT38.4 Q38.3(D)
NetBT39_3: BT39.3 R65.2
NetBT39_4: BT39.4 Q39.3(D)
NetBT40_3: BT40.3 R79.2
NetBT40_4: BT40.4 Q40.3(D)
NetBT41_3: BT41.3 R80.2
NetBT41_4: BT41.4 Q41.3(D)
NetBT42_3: BT42.3 R81.2
NetBT42_4: BT42.4 Q42.3(D)
NetBT43_3: BT43.3 R82.2
NetBT43_4: BT43.4 Q43.3(D)
NetBT44_3: BT44.3 R83.2
NetBT44_4: BT44.4 Q44.3(D)
NetBT45_3: BT45.3 R84.2
NetBT45_4: BT45.4 Q45.3(D)
NetBT46_3: BT46.3 R85.2
NetBT46_4: BT46.4 Q46.3(D)
NetBT47_3: BT47.3 R86.2
NetBT47_4: BT47.4 Q47.3(D)
NetBT48_3: BT48.3 R87.2
NetBT48_4: BT48.4 Q48.3(D)
NetBT49_3: BT49.3 R88.2
NetBT49_4: BT49.4 Q49.3(D)
NetBT50_3: BT50.3 R89.2
NetBT50_4: BT50.4 Q50.3(D)
NetBT51_3: BT51.3 R90.2
NetBT51_4: BT51.4 Q51.3(D)
NetBT52_3: BT52.3 R91.2
NetBT52_4: BT52.4 Q52.3(D)
NetBT53_3: BT53.3 R105.2
NetBT53_4: BT53.4 Q53.3(D)
NetBT54_3: BT54.3 R106.2
NetBT54_4: BT54.4 Q54.3(D)
NetBT55_3: BT55.3 R107.2
NetBT55_4: BT55.4 Q55.3(D)
NetBT56_3: BT56.3 R108.2
NetBT56_4: BT56.4 Q56.3(D)
NetBT57_3: BT57.3 R109.2
NetBT57_4: BT57.4 Q57.3(D)
NetBT58_3: BT58.3 R110.2
NetBT58_4: BT58.4 Q58.3(D)
NetBT59_3: BT59.3 R111.2
NetBT59_4: BT59.4 Q59.3(D)
NetBT60_3: BT60.3 R112.2
NetBT60_4: BT60.4 Q60.3(D)
NetBT61_3: BT61.3 R113.2
NetBT61_4: BT61.4 Q61.3(D)
NetBT62_3: BT62.3 R114.2
NetBT62_4: BT62.4 Q62.3(D)
NetBT63_3: BT63.3 R115.2
NetBT63_4: BT63.4 Q63.3(D)
NetBT64_3: BT64.3 R116.2
NetBT64_4: BT64.4 Q64.3(D)
NetBT65_3: BT65.3 R117.2
NetBT65_4: BT65.4 Q65.3(D)
NetBT66_3: BT66.3 R131.2
NetBT66_4: BT66.4 Q66.3(D)
NetBT67_3: BT67.3 R132.2
NetBT67_4: BT67.4 Q67.3(D)
NetBT68_3: BT68.3 R133.2
NetBT68_4: BT68.4 Q68.3(D)
NetBT69_3: BT69.3 R134.2
NetBT69_4: BT69.4 Q69.3(D)
NetBT70_3: BT70.3 R135.2
NetBT70_4: BT70.4 Q70.3(D)
NetBT71_3: BT71.3 R136.2
NetBT71_4: BT71.4 Q71.3(D)
NetBT72_3: BT72.3 R137.2
NetBT72_4: BT72.4 Q72.3(D)
NetBT73_3: BT73.3 R138.2
NetBT73_4: BT73.4 Q73.3(D)
NetBT74_3: BT74.3 R139.2
NetBT74_4: BT74.4 Q74.3(D)
NetBT75_3: BT75.3 R140.2
NetBT75_4: BT75.4 Q75.3(D)
NetBT76_3: BT76.3 R141.2
NetBT76_4: BT76.4 Q76.3(D)
NetBT77_3: BT77.3 R142.2
NetBT77_4: BT77.4 Q77.3(D)
NetBT78_3: BT78.3 R143.2
NetBT78_4: BT78.4 Q78.3(D)
NetBT79_3: BT79.3 R157.2
NetBT79_4: BT79.4 Q79.3(D)
NetBT80_3: BT80.3 R158.2
NetBT80_4: BT80.4 Q80.3(D)
NetBT81_3: BT81.3 R159.2
NetBT81_4: BT81.4 Q81.3(D)
NetBT82_3: BT82.3 R160.2
NetBT82_4: BT82.4 Q82.3(D)
NetBT83_3: BT83.3 R161.2
NetBT83_4: BT83.4 Q83.3(D)
NetBT84_3: BT84.3 R162.2
NetBT84_4: BT84.4 Q84.3(D)
NetBT85_3: BT85.3 R163.2
NetBT85_4: BT85.4 Q85.3(D)
NetBT86_3: BT86.3 R164.2
NetBT86_4: BT86.4 Q86.3(D)
NetBT87_3: BT87.3 R165.2
NetBT87_4: BT87.4 Q87.3(D)
NetBT88_3: BT88.3 R166.2
NetBT88_4: BT88.4 Q88.3(D)
NetBT89_3: BT89.3 R167.2
NetBT89_4: BT89.4 Q89.3(D)
NetBT90_3: BT90.3 R168.2
NetBT90_4: BT90.4 Q90.3(D)
NetBT91_3: BT91.3 R169.2
NetBT91_4: BT91.4 Q91.3(D)
NetH1_3: H1.3 R197.2
NetH2_3: H2.3 R199.2
NetH3_3: H3.3 R200.2

Not connected (* = marked no-connect by the designer): U1 7(QH)*; U2 7(QH)*; U3 7(QH)*; U4 7(QH)*; U5 7(QH)*; U6 7(QH)*; U7 7(QH)*; U8 7(QH)*; U9 7(QH)*; U10 7(QH)*; U11 7(QH)*; U12 7(QH)* 9(DATAO)*; U13 7(QH)*

## Notes on the sheet
- (in symbol XH2.54 4PZZ) XH2.54

## Library data of the parts
BT1-BT91 = Metal Push Button Switch: ComponentLink1Description: Link
C1-C26 C34-C42 = 0603 100nF: 100nF ±10% 50V Ceramic Capacitor X7R 0603; Manufacturer: YAGEO; Mfr. Part #: CC0603KRX7R9BB104; LCSC Part #: C14663; ComponentLink1URL: https://www.lcsc.com/product-detail/C14663.html?s_z=n_0603%2520100nF
  C1-C26 C34-C40: ComponentLink1Description: Link
  C41 C42: ComponentLink1Description: LCSC Link
C27-C33 = 1210 22uF 25V X7R: 22uF ±10% 25V Ceramic Capacitor X7R 1210; Manufacturer: Samsung Electro-Mechanics; Mfr. Part #: CL32B226KAJNNNE; LCSC Part #: C309062; ComponentLink1Description: Link; ComponentLink1URL: https://www.lcsc.com/product-detail/C309062.html?s_z=n_22uF%25201210
H1-H3 = XH2.54 4PZZ: XH 1 4P -25℃~+85℃ 2.54mm 4 2A 250V 1x4P Through Hole,P=2.54mm Headers, Male Pins RoHS; Manufacturer: XYECONN; Mfr. Part #: XY-XH2.54-4PZZ; LCSC Part #: C53201003; ComponentLink1Description: LCSC Link; ComponentLink1URL: https://www.lcsc.com/product-detail/C53201003.html?s_z=n_XH2.54%25204P; Package: Through Hole,P=2.54mm; Type: Header; Assembly Type: DIP Assembly; ComponentLink2Description: Datasheet; ComponentLink2URL: https://www.lcsc.com/datasheet/C53201003.pdf
Q1-Q91 = SI2308A: N-Channel 60V 3A 1.25W Surface Mount SOT-23; Manufacturer: UMW; Key Attributes: MOSFET N-CH 60V 3A SOT-23; type: Mosfet; Unit: Pcs; Assembly: SMT; ComponentLink1Description: Link; ComponentLink1URL: https://www.lcsc.com/product-detail/C347491.html?s_z=n_q_si2308&spm=wm.fly.bg.1.xh&lcsc_vid=Q1VfX1ReRFFaUFJSRgIIUV0CFFgIBFJfT1hdVlwEEVkxVlNRT1daUlxeQlReVzsOAxUeFF5JWBYZEEoKFBINSQcJGk4NBhADEA4cHktXQFFADxALGw%3D%3D; Mfr. Part #: SI2308A; LCSC Part #: C347491; Package: SOT-23; Category: SI2308A
R1-R13 R27-R39 R53-R65 R79-R91 R105-R117 R131-R143 R157-R169 R197 R199 R200 = 0603 220R: 100mW 220Ω 75V Thick Film Resistor ±1% ±100ppm/℃ 0603 Chip Resistor - Surface Mount RoHS; Mfr. Part #: CRCW0603220RFKEAHP; Manufacturer: VISHAY; LCSC Part #: C313707; ComponentLink1URL: https://www.lcsc.com/product-detail/C313707.html?s_z=n_0603%2520220R
  R1-R13 R27-R39 R53-R65 R79-R91 R105-R117 R131-R143 R157-R169: ComponentLink1Description: Link
  R197 R199 R200: ComponentLink1Description: LCSC Link; Value: 220R
R14-R26 R40-R52 R66-R78 R92-R104 R118-R130 R144-R156 R170-R196 R198 = 0603 10K: 100mW 10kΩ 75V Thick Film Resistor ±1% ±100ppm/℃ 0603 Chip Resistor - Surface Mount RoHS; Manufacturer: VISHAY; Mfr. Part #: CRCW060310K0FKEA; LCSC Part #: C844918; ComponentLink1URL: https://www.lcsc.com/product-detail/C844918.html?s_z=n_10K
  R14-R26 R40-R52 R66-R78 R92-R104 R118-R130 R144-R156 R170-R195: ComponentLink1Description: Link
  R196 R198: ComponentLink1Description: LCSC Link
U1-U13 = 74HC595 SMD: 2V~6V 1 100ns@5V,50pF Serial-to-Serial or Parallel SOP-16 Shift Registers RoHS; Manufacturer: GR; Key Attributes: 8-bit CMOS shift register; Unit: Pcs; Assembly: SMT; ComponentLink1Description: Link; ComponentLink1URL: https://www.lcsc.com/product-detail/C18164493.html?s_z=n_q_x_74hc595&spm=wm.ssy.em.0.tz&lcsc_vid=Q1VfX1ReRFFaUFJSRgIIUV0CFFgIBFJfT1hdVlwEEVkxVlNRT1ddX1RVRFFcVjsOAxUeFF5JWBYZEEoKFBINSQcJGk4%3D; Mfr. Part #: 74HC595; LCSC Part #: C18164493; Package: SOP-16; type: IC; categoty: 74HC595